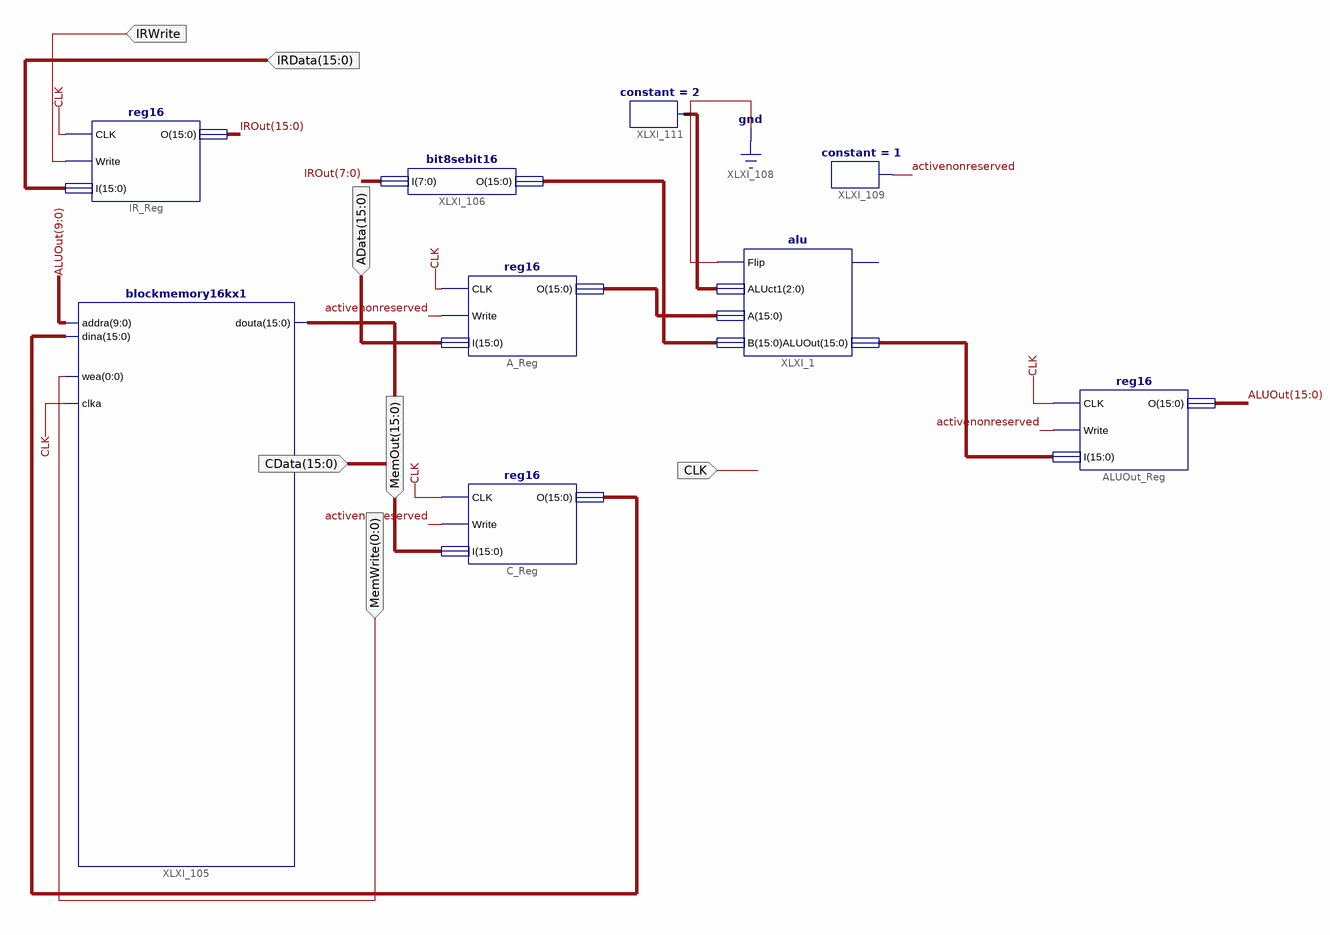
[diagram p0: schematic sheet 1]
// Xilinx ISE schematic memtoreg.sch (spartan3adsp) as structural Verilog: 9 symbols, 7 ports
module memtoreg (
  input  [15:0] AData,
  input  CLK,
  input  [0:0] MemWrite,
  input  [15:0] CData,
  input  IRWrite,
  input  [15:0] IRData,
  output [15:0] MemOut
);

  wire activenonreserved;
  wire [2:0] XLXN_6;
  wire [15:0] ALUOut, IROut, XLXN_1, XLXN_4, XLXN_8, XLXN_23;

  reg16 ALUOut_Reg (.CLK(CLK), .Write(activenonreserved), .I(XLXN_8), .O(ALUOut));
  reg16 C_Reg (.CLK(CLK), .Write(activenonreserved), .I(CData), .O(XLXN_23));
  reg16 A_Reg (.CLK(CLK), .Write(activenonreserved), .I(AData), .O(XLXN_1));
  reg16 IR_Reg (.CLK(CLK), .Write(IRWrite), .I(IRData), .O(IROut));
  blockmemory16kx1 XLXI_105 (.addra(ALUOut[9:0]), .dina(XLXN_23), .wea(MemWrite[0]), .clka(CLK), .douta(MemOut));
  bit8sebit16 XLXI_106 (.I(IROut[7:0]), .O(XLXN_4));
  constant #(.CValue("1")) XLXI_109 (.O(activenonreserved));
  alu XLXI_1 (.Flip(1'b0), .ALUct1(XLXN_6), .A(XLXN_1), .B(XLXN_4), .ALUOut(XLXN_8));  // open: Zero
  constant #(.CValue("2")) XLXI_111 (.O(XLXN_6));
endmodule
